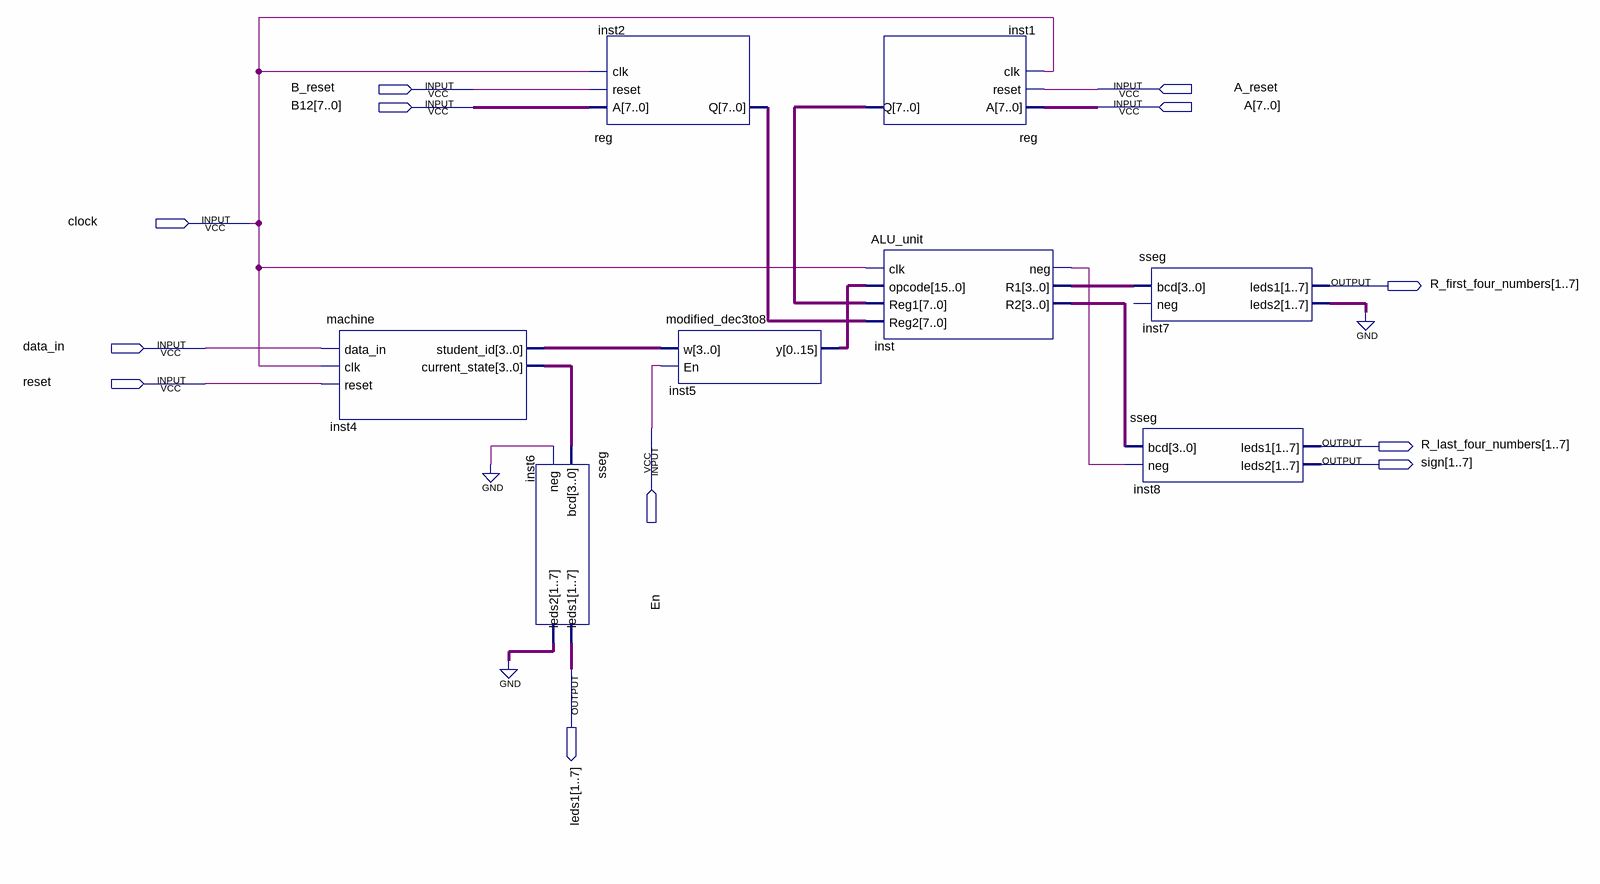
[diagram p0: schematic sheet]
// Quartus schematic CPU.bdf as structural Verilog: 8 symbols, 12 pins
module CPU (
  input  B_reset,
  input  A_reset,
  input  [7:0] B12,
  input  [7:0] A,
  input  clock,
  input  data_in,
  input  reset,
  input  En,
  output [1:7] R_first_four_numbers,
  output [1:7] R_last_four_numbers,
  output [1:7] sign,
  output [1:7] leds1
);

  wire inst_neg;
  wire [3:0] inst4_current_state, inst4_student_id, inst_r1, inst_r2;
  wire [6:0] inst6_leds2, inst7_leds2;
  wire [7:0] inst1_q, inst2_q;
  wire [15:0] inst5_y;

  machine inst4 (
    .data_in(data_in), .clk(clock), .reset(reset), .student_id(inst4_student_id),
    .current_state(inst4_current_state));
  sseg inst6 (.bcd(inst4_current_state), .neg(1'b0), .leds1(leds1), .leds2(inst6_leds2));
  \reg  inst2 (.A(B12), .reset(B_reset), .clk(clock), .Q(inst2_q));
  modified_dec3to8 inst5 (.w(inst4_student_id), .En(En), .y(inst5_y));
  \reg  inst1 (.A(A), .reset(A_reset), .clk(clock), .Q(inst1_q));
  ALU_unit inst (
    .clk(clock), .opcode(inst5_y), .Reg1(inst1_q), .Reg2(inst2_q), .neg(inst_neg), .R1(inst_r1), .R2(inst_r2));
  sseg inst7 (.bcd(inst_r1), .leds1(R_first_four_numbers), .leds2(inst7_leds2));  // open: neg
  sseg inst8 (.bcd(inst_r2), .neg(inst_neg), .leds1(R_last_four_numbers), .leds2(sign));
  // also tied to GND on the sheet: {inst7_leds2[0], inst7_leds2[1], inst7_leds2[2], inst7_leds2[3], inst7_leds2[4], inst7_leds2[5], inst7_leds2[6], inst6_leds2[0], inst6_leds2[1], inst6_leds2[2], inst6_leds2[3], inst6_leds2[4], inst6_leds2[5], inst6_leds2[6]}
endmodule
